# Altium schematic sheet main.SchDoc
size A4
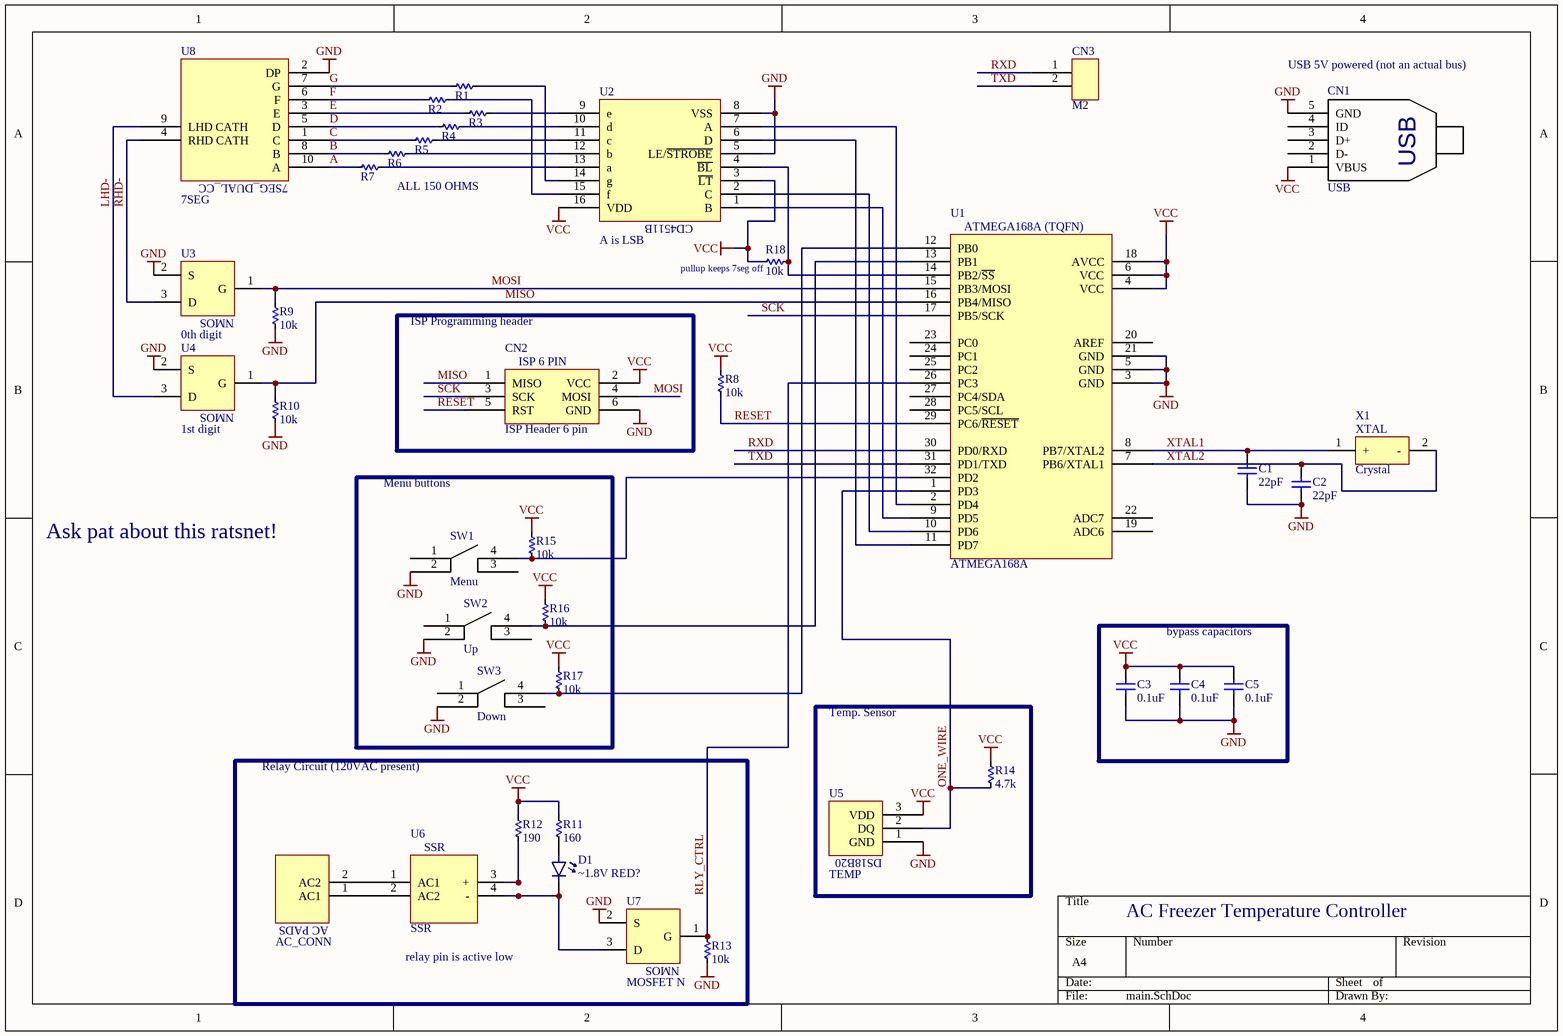
[diagram p0: main.SchDoc]

## Parts
?  AC_CONN  [AC_PADS]
C1  value 22pF  [0402_CAP]  (hidden comment: CAPACITOR)
C2  value 22pF  [0402_CAP]  (hidden comment: CAPACITOR)
C3  value 0.1uF  [0402_CAP]  (hidden comment: CAPACITOR)
C4  value 0.1uF  [0402_CAP]  (hidden comment: CAPACITOR)
C5  value 0.1uF  [0402_CAP]  (hidden comment: CAPACITOR)
CN1  USB  [USB Mini B 1]
CN2  ISP Header 6 pin  [M3x2]
CN3  M2  [M2]
D1  ~1.8V RED?  [LED_5mm]
R1  RESISTOR  [0402_RES]  (value not drawn)
R2  RESISTOR  [0402_RES]  (value not drawn)
R3  RESISTOR  [0402_RES]  (value not drawn)
R4  RESISTOR  [0402_RES]  (value not drawn)
R5  RESISTOR  [0402_RES]  (value not drawn)
R6  RESISTOR  [0402_RES]  (value not drawn)
R7  RESISTOR  [0402_RES]  (value not drawn)
R8  value 10k  [0603_RES]  (hidden comment: RESISTOR)
R9  value 10k  [0603_RES]  (hidden comment: RESISTOR)
R10  value 10k  [0603_RES]  (hidden comment: RESISTOR)
R11  value 160  [0603_RES]  (hidden comment: RESISTOR)
R12  value 190  [0603_RES]  (hidden comment: RESISTOR)
R13  value 10k  [0603_RES]  (hidden comment: RESISTOR)
R14  value 4.7k  [0603_RES]  (hidden comment: RESISTOR)
R15  value 10k  [0603_RES]  (hidden comment: RESISTOR)
R16  value 10k  [0603_RES]  (hidden comment: RESISTOR)
R17  value 10k  [0603_RES]  (hidden comment: RESISTOR)
R18  value 10k  [0603_RES]  (hidden comment: RESISTOR)
SW1  Menu  [SWITCH PTS645]
SW2  Up  [SWITCH PTS645]
SW3  Down  [SWITCH PTS645]
U1  ATMEGA168A  [ATMEGA168-32A]
U2  A is LSB  [CD4511B-NS]
U3  0th digit  [SOT23-3]
U4  1st digit  [SOT23-3]
U5  TEMP  [M3]
U6  SSR  [SHARP_SSR]
U7  MOSFET N  [SOT23-3]
U8  7SEG  [7SEG RED]
X1  Crystal  [CRYSTAL CSM-3X]

## Blocks framed on the sheet
ISP Programming header: CN2
Menu buttons: R15-R17 SW1-SW3
bypass capacitors: C3-C5
Temp. Sensor: R14 U5

## Nets
GND: C1.1 C2.1 C3.1 C4.1 C5.1 CN1.5(GND) CN2.6(GND) R9.1 R10.1 R13.1 SW1.2 SW2.2 SW3.2 U1.3(GND) U1.5(GND) U1.21(GND) U2.5(LE/~{STROBE}) U2.8(VSS) U3.2(S) U4.2(S) U5.1(GND) U7.2(S) U8.2(DP)
VCC: C3.2 C4.2 C5.2 CN1.1(VBUS) CN2.2(VCC) R8.2 R11.2 R12.2 R14.2 R15.2 R16.2 R17.2 R18.1 U1.4(VCC) U1.6(VCC) U1.18(AVCC) U2.3(~{LT}) U2.16(VDD) U5.3(VDD)
A: R7.1 U8.10(A)
B: R6.1 U8.8(B)
C: R5.1 U8.1(C)
D: R4.1 U8.5(D)
E: R3.1 U8.3(E)
F: R2.1 U8.6(F)
G: R1.1 U8.7(G)
LHD-: U4.3(D) U8.9(LHD_CATH)
MISO: CN2.1(MISO) R10.2 U1.16(PB4/MISO) U4.1(G)
MOSI: CN2.4(MOSI) R9.2 U1.15(PB3/MOSI) U3.1(G)
ONE_WIRE: R14.1 U1.1(PD3) U5.2(DQ)
RESET: CN2.5(RST) R8.1 U1.29(PC6/~{RESET})
RHD-: U3.3(D) U8.4(RHD_CATH)
RLY_CTRL: R13.2 U1.26(PC3) U7.1(G)
RXD: CN3.1 U1.30(PD0/RXD)
SCK: CN2.3(SCK) U1.17(PB5/SCK)
TXD: CN3.2 U1.31(PD1/TXD)
XTAL1: C1.2 U1.8(PB7/XTAL2) X1.1(+)
XTAL2: C2.2 U1.7(PB6/XTAL1) X1.2(-)
Net?_1: ?.1(AC1) U6.2(AC2)
Net?_2: ?.2(AC2) U6.1(AC1)
NetD1_1: D1.1(+) R11.1
NetD1_2: D1.2(-) U6.4(-) U7.3(D)
NetR1_2: R1.2 U2.14(g)
NetR2_2: R2.2 U2.15(f)
NetR3_2: R3.2 U2.9(e)
NetR4_2: R4.2 U2.10(d)
NetR5_2: R5.2 U2.11(c)
NetR6_2: R6.2 U2.12(b)
NetR7_2: R7.2 U2.13(a)
NetR12_1: R12.1 U6.3(+)
NetR15_1: R15.1 SW1.4 U1.32(PD2)
NetR16_1: R16.1 SW2.4 U1.13(PB1)
NetR17_1: R17.1 SW3.4 U1.12(PB0)
NetR18_2: R18.2 U1.14(PB2/~{SS}) U2.4(~{BL})
NetU1_2: U1.2(PD4) U2.7(A)
NetU1_9: U1.9(PD5) U2.1(B)
NetU1_10: U1.10(PD6) U2.2(C)
NetU1_11: U1.11(PD7) U2.6(D)

Not connected (* = marked no-connect by the designer): CN1 2(D-) 3(D+) 4(ID); SW1 1 3; SW2 1 3; SW3 1 3; U1 19(ADC6) 20(AREF) 22(ADC7) 23(PC0) 24(PC1) 25(PC2) 27(PC4/SDA) 28(PC5/SCL)

## Notes on the sheet
- (near CN1) USB 5V powered (not an actual bus)
- ALL 150 OHMS
- (near R18) pullup keeps 7seg off
- Ask pat about this ratsnet!
- Relay Circuit (120VAC present)
- AC Freezer Temperature Controller
- relay pin is active low
- (in symbol 7SEG) 7SEG_DUAL_CC
- (in symbol AC_CONN) AC PADS
- (in symbol ATMEGA168A) ATMEGA168A (TQFN)
- (in symbol Crystal) XTAL
- (in symbol ISP Header 6 pin) ISP 6 PIN
- (in symbol MOSFET N) NMOS

## Library data of the parts
D1 = LED
R1-R7 = RESISTOR: VALUE: 1
SW1-SW3 = SPST Switch
U2 = CD4511B
U3 U4 = MOSFET N
U5 = DS18B20